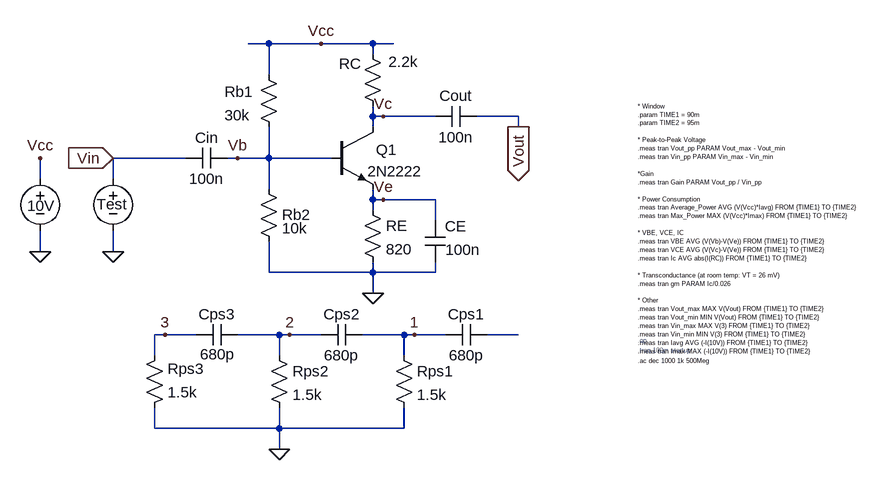
[diagram p0: schematic JlabProject1.asc]
JlabProject1.asc, the LTspice schematic file:
Version 4
SHEET 1 2180 1844
WIRE 272 -304 240 -304
WIRE 352 -304 272 -304
WIRE 432 -304 352 -304
WIRE 464 -304 432 -304
WIRE 432 -288 432 -304
WIRE 272 -256 272 -304
WIRE 432 -192 432 -208
WIRE 448 -192 432 -192
WIRE 528 -192 448 -192
WIRE 656 -192 592 -192
WIRE 432 -176 432 -192
WIRE 656 -176 656 -192
WIRE 144 -128 32 -128
WIRE 224 -128 208 -128
WIRE 272 -128 272 -176
WIRE 272 -128 224 -128
WIRE 368 -128 272 -128
WIRE -80 -96 -80 -128
WIRE 32 -96 32 -128
WIRE 272 -80 272 -128
WIRE 432 -64 432 -80
WIRE 448 -64 432 -64
WIRE 528 -64 448 -64
WIRE 432 -48 432 -64
WIRE 528 -32 528 -64
WIRE -80 16 -80 -16
WIRE 32 16 32 -16
WIRE 272 48 272 0
WIRE 432 48 432 32
WIRE 432 48 272 48
WIRE 528 48 528 32
WIRE 528 48 432 48
WIRE 432 80 432 48
WIRE 112 144 96 144
WIRE 160 144 112 144
WIRE 288 144 224 144
WIRE 304 144 288 144
WIRE 352 144 304 144
WIRE 480 144 416 144
WIRE 496 144 480 144
WIRE 544 144 496 144
WIRE 656 144 608 144
WIRE 96 176 96 144
WIRE 288 176 288 144
WIRE 480 176 480 144
WIRE 96 288 96 256
WIRE 288 288 288 256
WIRE 288 288 96 288
WIRE 480 288 480 256
WIRE 480 288 288 288
WIRE 288 320 288 288
FLAG 288 320 0
FLAG -80 16 0
FLAG 432 80 0
FLAG 656 -176 Vout
IOPIN 656 -176 Out
FLAG 352 -304 Vcc
FLAG 224 -128 Vb
FLAG 448 -192 Vc
FLAG 448 -64 Ve
FLAG 496 144 1
FLAG 304 144 2
FLAG 112 144 3
FLAG 32 -128 Vin
IOPIN 32 -128 In
FLAG 32 16 0
FLAG -80 -128 Vcc
DATAFLAG 352 -128 "Ib(Q1)"
DATAFLAG 432 -240 "Ic(Q1)"
DATAFLAG 544 -64 "-Ie(Q1)"
DATAFLAG 272 -304 ""
DATAFLAG 432 -304 ""
DATAFLAG 96 96 ""
DATAFLAG 288 160 ""
DATAFLAG 480 160 ""
DATAFLAG 656 -192 ""
DATAFLAG 432 -192 ""
DATAFLAG 272 -112 ""
DATAFLAG 432 -64 ""
SYMBOL voltage -80 -112 M0
WINDOW 0 -23 57 Left 2
WINDOW 3 -2225 -1755 Invisible 2
WINDOW 123 0 0 Left 0
WINDOW 39 0 0 Left 0
SYMATTR InstName 10V
SYMATTR Value 10
SYMBOL npn 368 -176 R0
WINDOW 0 69 35 Left 2
SYMATTR InstName Q1
SYMATTR Value 2N2222
SYMBOL cap 224 128 R90
WINDOW 0 0 32 VBottom 2
WINDOW 3 30 31 VTop 2
SYMATTR InstName Cps3
SYMATTR Value 680p
SYMBOL cap 416 128 R90
WINDOW 0 0 32 VBottom 2
WINDOW 3 32 32 VTop 2
SYMATTR InstName Cps2
SYMATTR Value 680p
SYMBOL cap 608 128 R90
WINDOW 0 0 32 VBottom 2
WINDOW 3 32 32 VTop 2
SYMATTR InstName Cps1
SYMATTR Value 680p
SYMBOL cap 592 -208 R90
WINDOW 0 0 32 VBottom 2
WINDOW 3 32 32 VTop 2
SYMATTR InstName Cout
SYMATTR Value 100n
SYMBOL cap 512 -32 R0
WINDOW 0 31 9 Left 2
WINDOW 3 32 45 Left 2
SYMATTR InstName CE
SYMATTR Value 100n
SYMBOL res 256 -272 R0
WINDOW 0 -52 42 Left 2
WINDOW 3 -52 78 Left 2
SYMATTR InstName Rb1
SYMATTR Value 30k
SYMBOL res 416 -304 R0
WINDOW 0 -36 31 Left 2
WINDOW 3 40 28 Left 2
SYMATTR InstName RC
SYMATTR Value 2.2k
SYMBOL res 256 -96 R0
WINDOW 0 36 55 Left 2
SYMATTR InstName Rb2
SYMATTR Value 10k
SYMBOL res 416 -64 R0
SYMATTR InstName RE
SYMATTR Value 820
SYMBOL res 80 272 M180
WINDOW 0 36 76 Left 2
WINDOW 3 36 40 Left 2
SYMATTR InstName Rps3
SYMATTR Value 1.5k
SYMBOL res 272 160 R0
SYMATTR InstName Rps2
SYMATTR Value 1.5k
SYMBOL res 464 160 R0
SYMATTR InstName Rps1
SYMATTR Value 1.5k
SYMBOL voltage 32 -112 R0
WINDOW 0 -25 55 Left 2
WINDOW 3 -94 121 Left 2
WINDOW 39 0 0 Left 0
SYMATTR InstName Test
SYMATTR Value ""
SYMATTR Value2 AC 1
SYMBOL cap 208 -144 R90
WINDOW 0 0 32 VBottom 2
WINDOW 3 32 32 VTop 2
SYMATTR InstName Cin
SYMATTR Value 100n
TEXT 840 168 Left 0 ;.tran 100m startup
TEXT 840 152 Left 0 ;.op
TEXT 840 184 Left 0 !.ac dec 1000 1k 500Meg
TEXT 840 -208 Left 0 !* Window\n.param TIME1 = 90m\n.param TIME2 = 95m\n \n* Peak-to-Peak Voltage\n.meas tran Vout_pp PARAM Vout_max - Vout_min\n.meas tran Vin_pp PARAM Vin_max - Vin_min\n \n*Gain\n.meas tran Gain PARAM Vout_pp / Vin_pp\n \n* Power Consumption      \n.meas tran Average_Power AVG (V(Vcc)*Iavg) FROM {TIME1} TO {TIME2}\n.meas tran Max_Power MAX (V(Vcc)*Imax) FROM {TIME1} TO {TIME2}\n \n* VBE, VCE, IC\n.meas tran VBE AVG (V(Vb)-V(Ve)) FROM {TIME1} TO {TIME2}\n.meas tran VCE AVG (V(Vc)-V(Ve)) FROM {TIME1} TO {TIME2}\n.meas tran Ic AVG abs(I(RC)) FROM {TIME1} TO {TIME2}   \n \n* Transconductance (at room temp: VT = 26 mV)\n.meas tran gm PARAM Ic/0.026\n \n* Other\n.meas tran Vout_max MAX V(Vout) FROM {TIME1} TO {TIME2}\n.meas tran Vout_min MIN V(Vout) FROM {TIME1} TO {TIME2}\n.meas tran Vin_max MAX V(3) FROM {TIME1} TO {TIME2}\n.meas tran Vin_min MIN V(3) FROM {TIME1} TO {TIME2}\n.meas tran Iavg AVG (-I(10V)) FROM {TIME1} TO {TIME2}\n.meas tran Imax MAX (-I(10V)) FROM {TIME1} TO {TIME2}

The netlist it stands for:
* JlabProject1.asc
V§10V Vcc 0 10
Q1 Vc Vb Ve 0 2N2222
Cps3 2 3 680p
Cps2 1 2 680p
Cps1 N001 1 680p
Cout Vout Vc 100n
CE Ve 0 100n
Rb1 Vcc Vb 30k
RC Vcc Vc 2.2k
Rb2 Vb 0 10k
RE Ve 0 820
Rps3 0 3 1.5k
Rps2 2 0 1.5k
Rps1 1 0 1.5k
V§Test Vin 0 AC 1
Cin Vb Vin 100n
.model NPN NPN
.model PNP PNP
.lib standard.bjt
* .tran 100m startup
* .op
.ac dec 1000 1k 500Meg
* Window
.param TIME1 = 90m
.param TIME2 = 95m
* Peak-to-Peak Voltage
.meas tran Vout_pp PARAM Vout_max - Vout_min
.meas tran Vin_pp PARAM Vin_max - Vin_min
*Gain
.meas tran Gain PARAM Vout_pp / Vin_pp
* Power Consumption
.meas tran Average_Power AVG (V(Vcc)*Iavg) FROM {TIME1} TO {TIME2}
.meas tran Max_Power MAX (V(Vcc)*Imax) FROM {TIME1} TO {TIME2}
* VBE, VCE, IC
.meas tran VBE AVG (V(Vb)-V(Ve)) FROM {TIME1} TO {TIME2}
.meas tran VCE AVG (V(Vc)-V(Ve)) FROM {TIME1} TO {TIME2}
.meas tran Ic AVG abs(I(RC)) FROM {TIME1} TO {TIME2}
* Transconductance (at room temp: VT = 26 mV)
.meas tran gm PARAM Ic/0.026
* Other
.meas tran Vout_max MAX V(Vout) FROM {TIME1} TO {TIME2}
.meas tran Vout_min MIN V(Vout) FROM {TIME1} TO {TIME2}
.meas tran Vin_max MAX V(3) FROM {TIME1} TO {TIME2}
.meas tran Vin_min MIN V(3) FROM {TIME1} TO {TIME2}
.meas tran Iavg AVG (-I(10V)) FROM {TIME1} TO {TIME2}
.meas tran Imax MAX (-I(10V)) FROM {TIME1} TO {TIME2}
.backanno
.end